# EAGLE design Actuator (EAGLE 9.6.2)

## Sheet 1 of 2
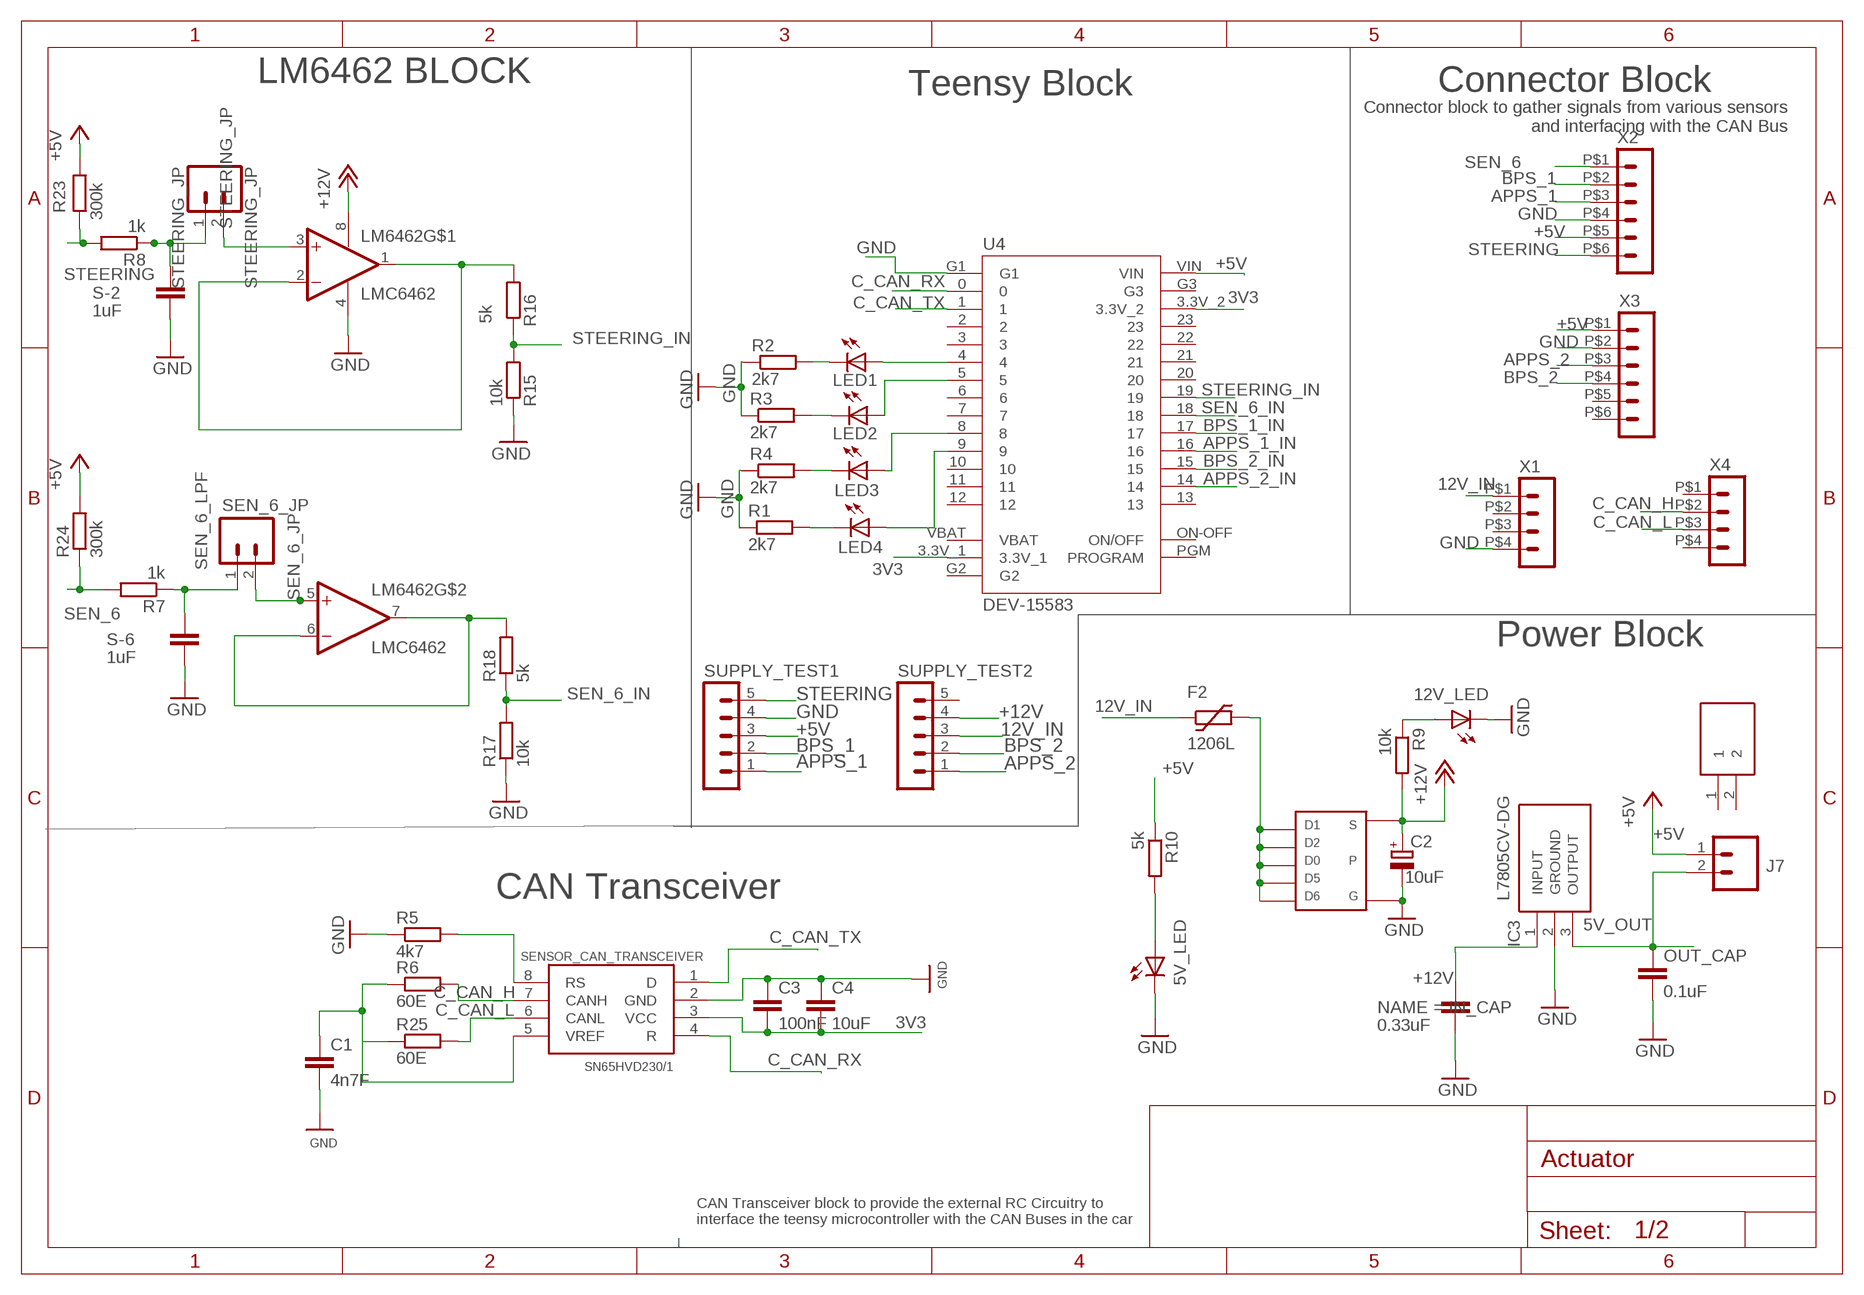
[diagram p0: schematic, sheet 1]

### Parts
5V_LED  LED1206  [LED-1206]
12V_LED  LED1206  [LED-1206]
C1  4n7F  C-EUC0805  [C0805]
C2  10uF  CPOL-EUE2.5-6  [E2,5-6]
C3  100nF  C-EUC0805  [C0805]
C4  10uF  C-EUC0805  [C0805]
F2  1206L  [1206L]
IC3  L7805CV-DG  [TO255P460X1020X2008-3P]
IN_CAP  0.33uF  C-EUC0805  [C0805]
J7  CONN_02  [1X02]
LED1  LED1206  [LED-1206]
LED2  LED1206  [LED-1206]
LED3  LED1206  [LED-1206]
LED4  LED1206  [LED-1206]
LM6462  LMC6462  [S08]
OUT_CAP  0.1uF  C-EUC0805  [C0805]
R1  2k7  R-EU_R0805  [R0805]
R2  2k7  R-EU_R0805  [R0805]
R3  2k7  R-EU_R0805  [R0805]
R4  2k7  R-EU_R0805  [R0805]
R5  4k7  R-EU_R0805  [R0805]
R6  60E  R-EU_R0805  [R0805]
R7  1k  R-EU_R0805  [R0805]
R8  1k  R-EU_R0805  [R0805]
R9  10k  R-EU_R0805  [R0805]
R10  5k  R-EU_R0805  [R0805]
R15  10k  R-EU_R0805  [R0805]
R16  5k  R-EU_R0805  [R0805]
R17  10k  R-EU_R0805  [R0805]
R18  5k  R-EU_R0805  [R0805]
R23  300k  R-EU_R0805  [R0805]
R24  300k  R-EU_R0805  [R0805]
R25  60E  R-EU_R0805  [R0805]
S-2  1uF  C-EUC0805  [C0805]
S-6  1uF  C-EUC0805  [C0805]
SEN_6_JP  SEN_6_JP  CONN_02  [1X02]
SENSOR_CAN_TRANSCEIVER  SN65HVD230/1  [SO8]
STEERING_JP  STEERING_JP  CONN_02  [1X02]
SUPPLY_TEST1  MA05-1  [MA05-1]
SUPPLY_TEST2  MA05-1  [MA05-1]
U3  HSS10-B20-P40  [HSS10B20P40]
U4  DEV-15583  [MODULE_DEV-15583]
U$1  TSOP-6_PMOS  [TSOP-6_PMOS]
X1  HEADER_POS4_43045-0412  [43045-0412]
X2  HEADER_POS6_43045-0612  [43045-0612]
X3  HEADER_POS6_43045-0612  [43045-0612]
X4  HEADER_POS4_43045-0412  [43045-0412]

### Nets
3V3: C3.2 C4.2 SENSOR_CAN_TRANSCEIVER.3(VCC) U4.3.3V_1 U4.3.3V_2
5V_OUT: IC3.3(OUTPUT) J7.2 OUT_CAP.1
12V_IN: F2.P$1 SUPPLY_TEST2.3 X1.P$1
+5V: J7.1 R10.1 R23.2 R24.2 SUPPLY_TEST1.3 U4.VIN X2.P$5 X3.P$1 ; also sheet 2
+12V: C2.+ IC3.1(INPUT) IN_CAP.1 LM6462.8(V+) R9.2 SUPPLY_TEST2.4 U$1.S ; also sheet 2
APPS_1: SUPPLY_TEST1.1 X2.P$3 ; also sheet 2
APPS_1_IN: U4.16 ; also sheet 2
APPS_2: SUPPLY_TEST2.1 X3.P$3 ; also sheet 2
APPS_2_IN: U4.14 ; also sheet 2
BPS_1: SUPPLY_TEST1.2 X2.P$2 ; also sheet 2
BPS_1_IN: U4.17 ; also sheet 2
BPS_2: SUPPLY_TEST2.2 X3.P$4 ; also sheet 2
BPS_2_IN: U4.15 ; also sheet 2
C_CAN_H: R6.2 SENSOR_CAN_TRANSCEIVER.7(CANH) X4.P$2
C_CAN_L: R25.2 SENSOR_CAN_TRANSCEIVER.6(CANL) X4.P$3
C_CAN_RX: SENSOR_CAN_TRANSCEIVER.4(R) U4.0
C_CAN_TX: SENSOR_CAN_TRANSCEIVER.1(D) U4.1
GND: 5V_LED.C 12V_LED.C C1.2 C2.- C3.1 C4.1 IC3.2(GROUND) IN_CAP.2 LM6462.4(V-) OUT_CAP.2 R1.1 R2.1 R3.1 R4.1 R5.1 R15.1 R17.1 S-2.2 S-6.2 SENSOR_CAN_TRANSCEIVER.2(GND) SUPPLY_TEST1.4 U4.G1 U$1.G X1.P$4 X2.P$4 X3.P$2 ; also sheet 2
N$1: R8.1 S-2.1 STEERING_JP.1
N$2: 5V_LED.A R10.2
N$4: R5.2 SENSOR_CAN_TRANSCEIVER.8(RS)
N$5: LED1.A U4.4
N$6: LED2.A U4.5
N$7: C1.1 R6.1 R25.1 SENSOR_CAN_TRANSCEIVER.5(VREF)
N$8: LED3.A U4.8
N$9: F2.P$2 U$1.1 U$1.2 U$1.5 U$1.6 U$1.D(D0)
N$10: LM6462.1(OUT) LM6462.2(-IN) R16.2
N$11: LED4.A U4.9
N$12: LED3.C R4.2
N$13: LED4.C R1.2
N$14: LED2.C R3.2
N$15: 12V_LED.A R9.1
N$16: LED1.C R2.2
N$18: LM6462.6(-IN) LM6462.7(OUT) R18.2
SEN_6: R7.2 R24.1 X2.P$1
SEN_6_IN: R17.2 R18.1 U4.18
SEN_6_JP: LM6462.5(+IN) SEN_6_JP.2
SEN_6_LPF: R7.1 S-6.1 SEN_6_JP.1
STEERING: R8.2 R23.1 SUPPLY_TEST1.5 X2.P$6
STEERING_IN: R15.2 R16.1 U4.19
STEERING_JP: LM6462.3(+IN) STEERING_JP.2
Unconnected: SUPPLY_TEST2.5 U3.1 U3.2 U4.2 U4.3 U4.6 U4.7 U4.10 U4.11 U4.12 U4.13 U4.20 U4.21 U4.22 U4.23 U4.ON-OFF(ON/OFF) U4.PGM(PROGRAM) X1.P$2 X1.P$3 X3.P$5 X3.P$6 X4.P$1 X4.P$4

### Notes on the sheet
- LM6462 BLOCK | Connector Block
- Teensy Block
- Connector block to gather signals from various sensors
   and interfacing with the CAN Bus
- Power Block
- CAN Transceiver
- CAN Transceiver block to provide the external RC Circuitry to 
  interface the teensy microcontroller with the CAN Buses in the car

## Sheet 2 of 2
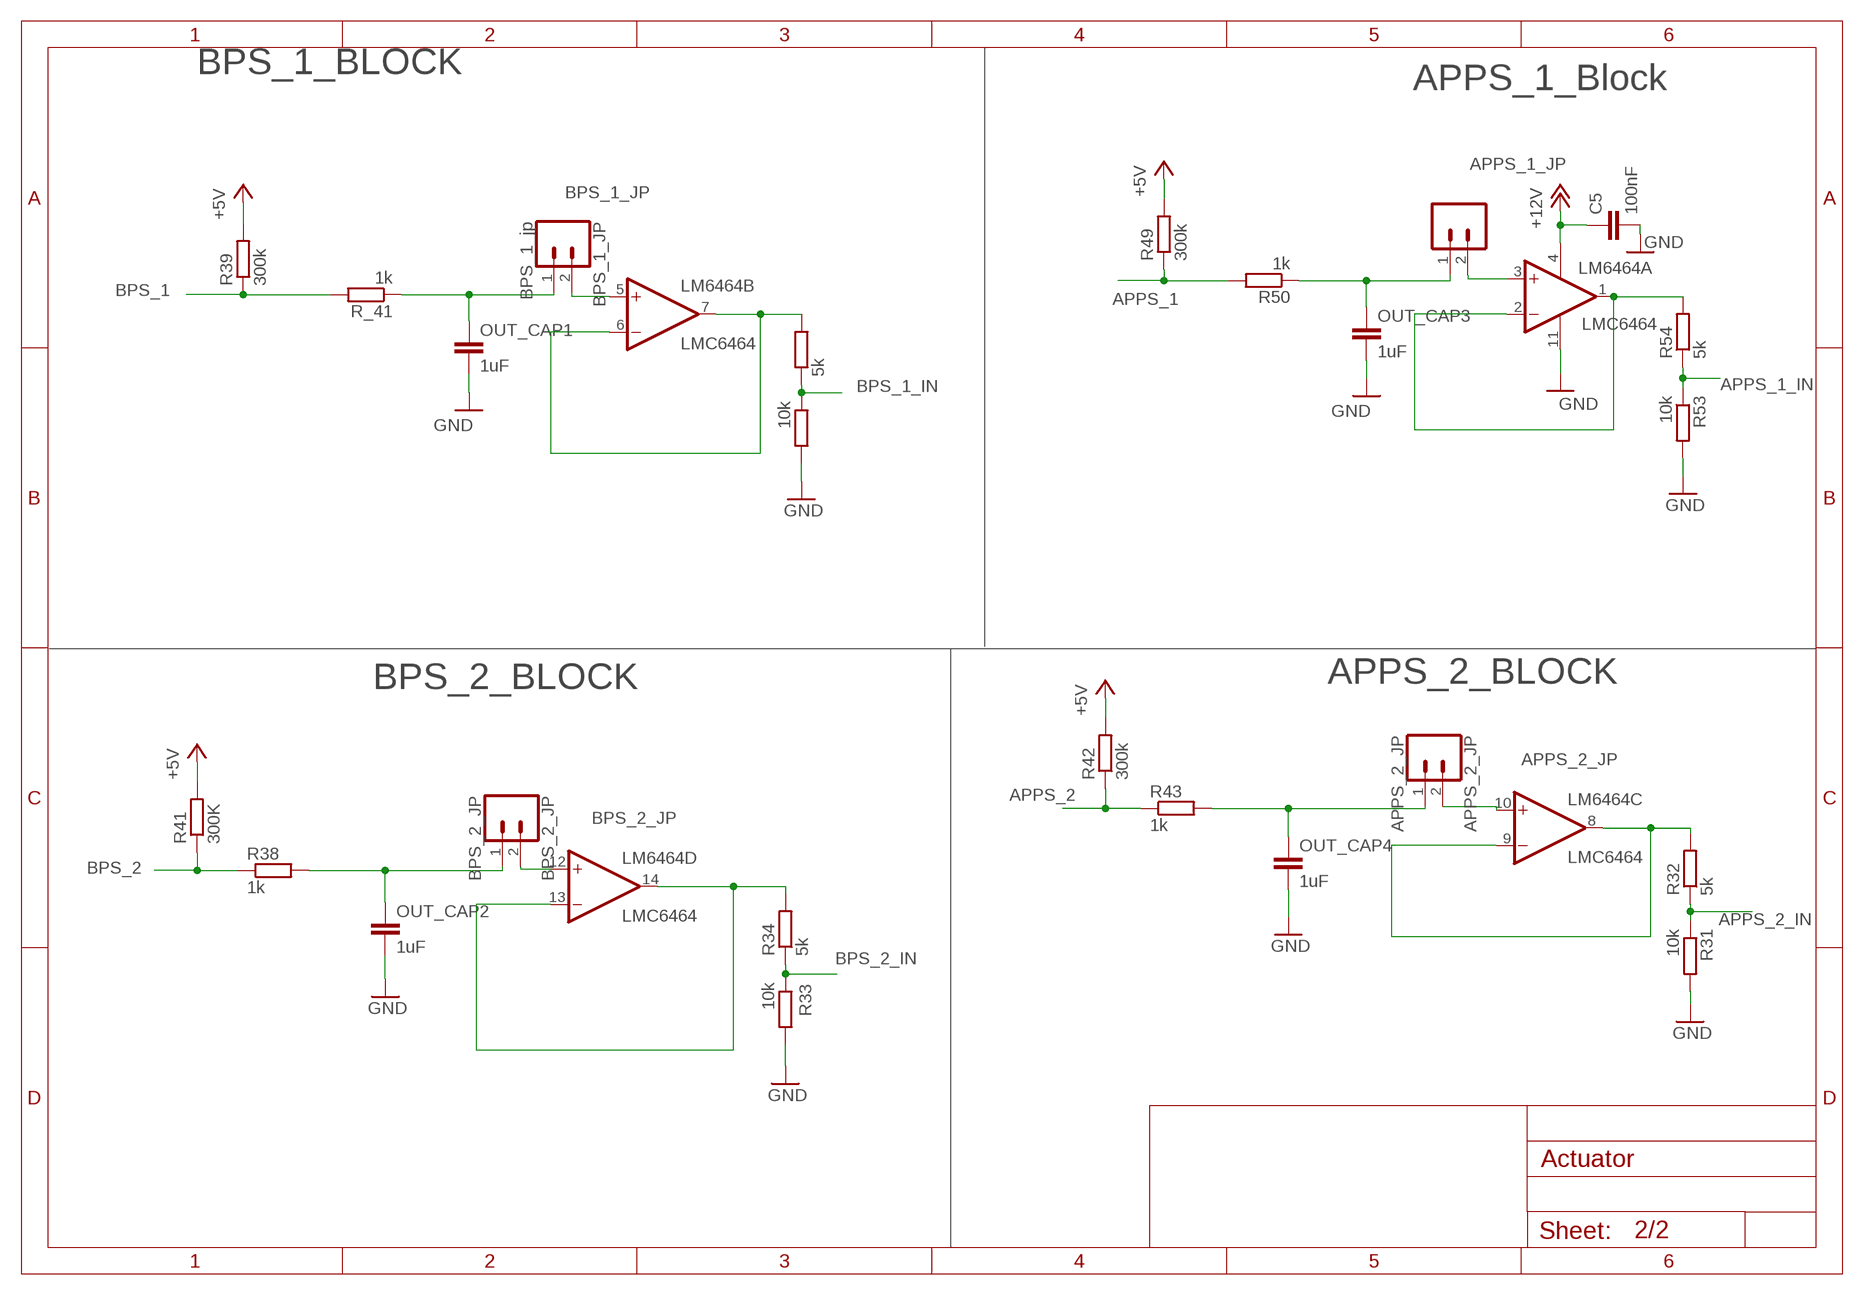
[diagram p1: schematic, sheet 2]

### Parts
APPS_1_JP  CONN_02  [1X02]
APPS_2_JP  APPS_2_JP  CONN_02  [1X02]
BPS_1_JP  BPS_1_jp  CONN_02  [1X02]
BPS_2_JP  BPS_2_JP  CONN_02  [1X02]
C5  100nF  C-EUC0805  [C0805]
LM6464  LMC6464  [SO14_LONGPADS]
OUT_CAP1  1uF  C-EUC0805  [C0805]
OUT_CAP2  1uF  C-EUC0805  [C0805]
OUT_CAP3  1uF  C-EUC0805  [C0805]
OUT_CAP4  1uF  C-EUC0805  [C0805]
R29  10k  R-EU_R0805  [R0805]
R30  5k  R-EU_R0805  [R0805]
R31  10k  R-EU_R0805  [R0805]
R32  5k  R-EU_R0805  [R0805]
R33  10k  R-EU_R0805  [R0805]
R34  5k  R-EU_R0805  [R0805]
R38  1k  R-EU_R0805  [R0805]
R39  300k  R-EU_R0805  [R0805]
R41  300K  R-EU_R0805  [R0805]
R42  300k  R-EU_R0805  [R0805]
R43  1k  R-EU_R0805  [R0805]
R49  300k  R-EU_R0805  [R0805]
R50  1k  R-EU_R0805  [R0805]
R53  10k  R-EU_R0805  [R0805]
R54  5k  R-EU_R0805  [R0805]
R_41  1k  R-EU_R0805  [R0805]

### Nets
+5V: R39.2 R41.2 R42.2 R49.2 ; also sheet 1
+12V: C5.1 LM6464.4(POW:V+) ; also sheet 1
APPS_1: R49.1 R50.2 ; also sheet 1
APPS_1_IN: R53.1 R54.1 ; also sheet 1
APPS_1_JP: APPS_1_JP.2 LM6464.3(A:+IN)
APPS_2: R42.1 R43.1 ; also sheet 1
APPS_2_IN: R31.1 R32.1 ; also sheet 1
APPS_2_JP: APPS_2_JP.2 LM6464.10(C:+IN)
BPS_1: R39.1 R_41.2 ; also sheet 1
BPS_1_IN: R29.1 R30.1 ; also sheet 1
BPS_1_JP: BPS_1_JP.2 LM6464.5(B:+IN)
BPS_2: R38.1 R41.1 ; also sheet 1
BPS_2_IN: R33.1 R34.1 ; also sheet 1
BPS_2_JP: BPS_2_JP.2 LM6464.12(D:+IN)
GND: C5.2 LM6464.11(POW:V-) OUT_CAP1.2 OUT_CAP2.2 OUT_CAP3.2 OUT_CAP4.2 R29.2 R31.2 R33.2 R53.2 ; also sheet 1
N$19: BPS_1_JP.1 OUT_CAP1.1 R_41.1
N$22: LM6464.8(C:OUT) LM6464.9(C:-IN) R32.2
N$25: LM6464.6(B:-IN) LM6464.7(B:OUT) R30.2
N$26: LM6464.13(D:-IN) LM6464.14(D:OUT) R34.2
N$29: APPS_2_JP.1 OUT_CAP4.1 R43.2
N$32: BPS_2_JP.1 OUT_CAP2.1 R38.2
N$33: APPS_1_JP.1 OUT_CAP3.1 R50.1
N$35: LM6464.1(A:OUT) LM6464.2(A:-IN) R54.2

### Notes on the sheet
- BPS_1_BLOCK
- APPS_1_Block
- BPS_2_BLOCK | APPS_2_BLOCK

## Power pins joined to a net without a drawn wire
G2: U4.G2
G3: U4.G3
VBAT: U4.VBAT

## Library data of the parts
5V_LED 12V_LED LED1-LED4 = SparkFun-LED:LED: LEDs Standard schematic elements and footprints for 5mm, 3mm, 1206, and 0603 sized LEDs. 5mm - Spark Fun Electronics SKU : COM-00529 (and others)
APPS_1_JP APPS_2_JP BPS_1_JP BPS_2_JP SEN_6_JP STEERING_JP = IIT_BOMBAY_Racing2:CONN_02: Multi connection point. Often used as Generic Header-pin footprint for 0.1 inch spaced/style header connections On any of the 0.1 inch spaced packages, you can populate with these: Break Away Headers - Straight <https://www.sparkfun.com/products/116> (PRT-00116) Break Away Male Headers - Right Angle <https://www.sparkfun.com/products/553> (PRT-00553) Female Headers <https://www.sparkfun.com/products/115> (PRT-00115) Break Away Headers - Machine Pin <https://www.sparkfun.com/products/117> (PRT-00117) Break Away Female Headers - Swiss Machine Pin <https://www.sparkfun.com/products/743> (PRT-00743) For SCREWTERMINALS and SPRING TERMINALS visit here: Screw Terimnals on SparkFun.com <https://www.sparkfun.com/search/results?term=Screw+Terminals> (5mm/3.5mm/2.54mm spacing) This device is also useful as a general connection point to wire up your design to another part of your project. Our various solder wires solder well into these plated through hole pads. Hook-Up Wire - Assortment (Stranded, 22 AWG) <https://www.sparkfun.com/products/11375> (PRT-11375) Hook-Up Wire - Assortment (Solid Core, 22 AWG) <https://www.sparkfun.com/products/11367> (PRT-11367) View the entire wire category on our website here <https://www.sparkfun.com/categories/141> Special notes: Molex polarized connector foot print use with: PRT-08233 with associated crimp pins and housings. 2.54_SCREWTERM for use with PRT-10571. 3.5mm Screw Terminal footprints for PRT-08084 5mm Screw Terminal footprints for use with PRT-08432
C1 C3-C5 IN_CAP OUT_CAP OUT_CAP1-OUT_CAP4 S-2 S-6 = IIT_BOMBAY_Racing:C-EU: CAPACITOR, European symbol
C2 = IIT_BOMBAY_Racing:CPOL-EU: POLARIZED CAPACITOR, European symbol
F2 = IIT_BOMBAY_Racing:1206L
IC3 = SamacSys_Parts:L7805CV-DG: Voltage Regulator 5V 4% 1.5A TO220 L7805CV-DG, Linear Voltage Regulator, Current Limit, Shut-Down 1.5A 5 V, 3-Pin TO220 Source: Datasheet <http://www.st.com/web/en/resource/technical/document/datasheet/CD00000444.pdf>; DESCRIPTION: Voltage Regulator 5V 4% 1.5A TO220 L7805CV-DG, Linear Voltage Regulator, Current Limit, Shut-Down 1.5A 5 V, 3-Pin TO220; HEIGHT: 4.6mm; MANUFACTURER_NAME: STMicroelectronics; MANUFACTURER_PART_NUMBER: L7805CV-DG; MOUSER_PART_NUMBER: 511-L7805CV-DG; MOUSER_PRICE-STOCK: https://www.mouser.co.uk/ProductDetail/STMicroelectronics/L7805CV-DG?qs=T%2FOtf55vL7c3O0as9P9fAw%3D%3D
J7 = SparkFun-Connectors:CONN_02: Multi connection point. Often used as Generic Header-pin footprint for 0.1 inch spaced/style header connections On any of the 0.1 inch spaced packages, you can populate with these: Break Away Headers - Straight <https://www.sparkfun.com/products/116> (PRT-00116) Break Away Male Headers - Right Angle <https://www.sparkfun.com/products/553> (PRT-00553) Female Headers <https://www.sparkfun.com/products/115> (PRT-00115) Break Away Headers - Machine Pin <https://www.sparkfun.com/products/117> (PRT-00117) Break Away Female Headers - Swiss Machine Pin <https://www.sparkfun.com/products/743> (PRT-00743) For SCREWTERMINALS and SPRING TERMINALS visit here: Screw Terimnals on SparkFun.com <https://www.sparkfun.com/search/results?term=Screw+Terminals> (5mm/3.5mm/2.54mm spacing) This device is also useful as a general connection point to wire up your design to another part of your project. Our various solder wires solder well into these plated through hole pads. Hook-Up Wire - Assortment (Stranded, 22 AWG) <https://www.sparkfun.com/products/11375> (PRT-11375) Hook-Up Wire - Assortment (Solid Core, 22 AWG) <https://www.sparkfun.com/products/11367> (PRT-11367) View the entire wire category on our website here <https://www.sparkfun.com/categories/141> Special notes: Molex polarized connector foot print use with: PRT-08233 with associated crimp pins and housings. 2.54_SCREWTERM for use with PRT-10571. 3.5mm Screw Terminal footprints for PRT-08084 5mm Screw Terminal footprints for use with PRT-08432
LM6462 = IIT_BOMBAY_Racing:LMC6462
LM6464 = IIT_BOMBAY_Racing2:LMC6464
R1-R4 = rcl:R-EU_: RESISTOR, European symbol; SPICEPREFIX: R
R5 R6 R9 R10 R25 = IIT_BOMBAY_Racing:R-EU_: RESISTOR, European symbol
R7 R8 R15-R18 R23 R24 R29-R34 R38 R39 R41-R43 R49 R50 R53 R54 R_41 = IIT_BOMBAY_Racing2:R-EU_: RESISTOR, European symbol
SENSOR_CAN_TRANSCEIVER = texas_1:SN65HVD230/1
SUPPLY_TEST1 SUPPLY_TEST2 = con-lstb:MA05-1: PIN HEADER; OC_FARNELL: unknown; OC_NEWARK: unknown
U3 = HSS10-B20-P40:HSS10-B20-P40: Heat Sinks heat sink, stamping, TO-220, 29.97 x 25. Source: Datasheet <https://www.cuidevices.com/product/resource/hss10-b20-p40.pdf>; DESCRIPTION: Heat Sinks heat sink, stamping, TO-220, 29.97 x 25.; HEIGHT: 29.97mm; MANUFACTURER_NAME: CUI Inc.; MANUFACTURER_PART_NUMBER: HSS10-B20-P40; MOUSER_PART_NUMBER: 490-HSS10-B20-P40; MOUSER_PRICE-STOCK: https://www.mouser.co.uk/ProductDetail/CUI-Devices/HSS10-B20-P40?qs=QNEnbhJQKvYYvwy4FCjq1A%3D%3D
U4 = DEV-15583:DEV-15583: RT1062 Teensy 4.0 i.MX ARM?? Cortex??-M7 MPU Embedded Evaluation Board Check availability <https://pricing.snapeda.com/parts/DEV-15583/SparkFun%20Electronics/view-part?ref=eda>; AVAILABILITY: In Stock; DESCRIPTION: RT1062 Teensy 4.0 series ARM?? Cortex??-M7 MPU Embedded Evaluation Board; MF: SparkFun Electronics; MP: DEV-15583; PACKAGE: None; PRICE: None; PURCHASE-URL: https://pricing.snapeda.com/search/part/DEV-15583/?ref=eda
U$1 = TSOP-6_MOS:TSOP-6_PMOS
X1 X4 = IIT_BOMBAY_Racing2:HEADER_POS4_?: Molex - Micro-Fit 3.0 Series connector, 3.00mm (0.118") pitch header, 4 positions.
X2 X3 = IIT_BOMBAY_Racing2:HEADER_POS6_?: Molex - Micro-Fit 3.0 Series connector, 3.00mm (0.118") pitch header, 6 positions.

## Board
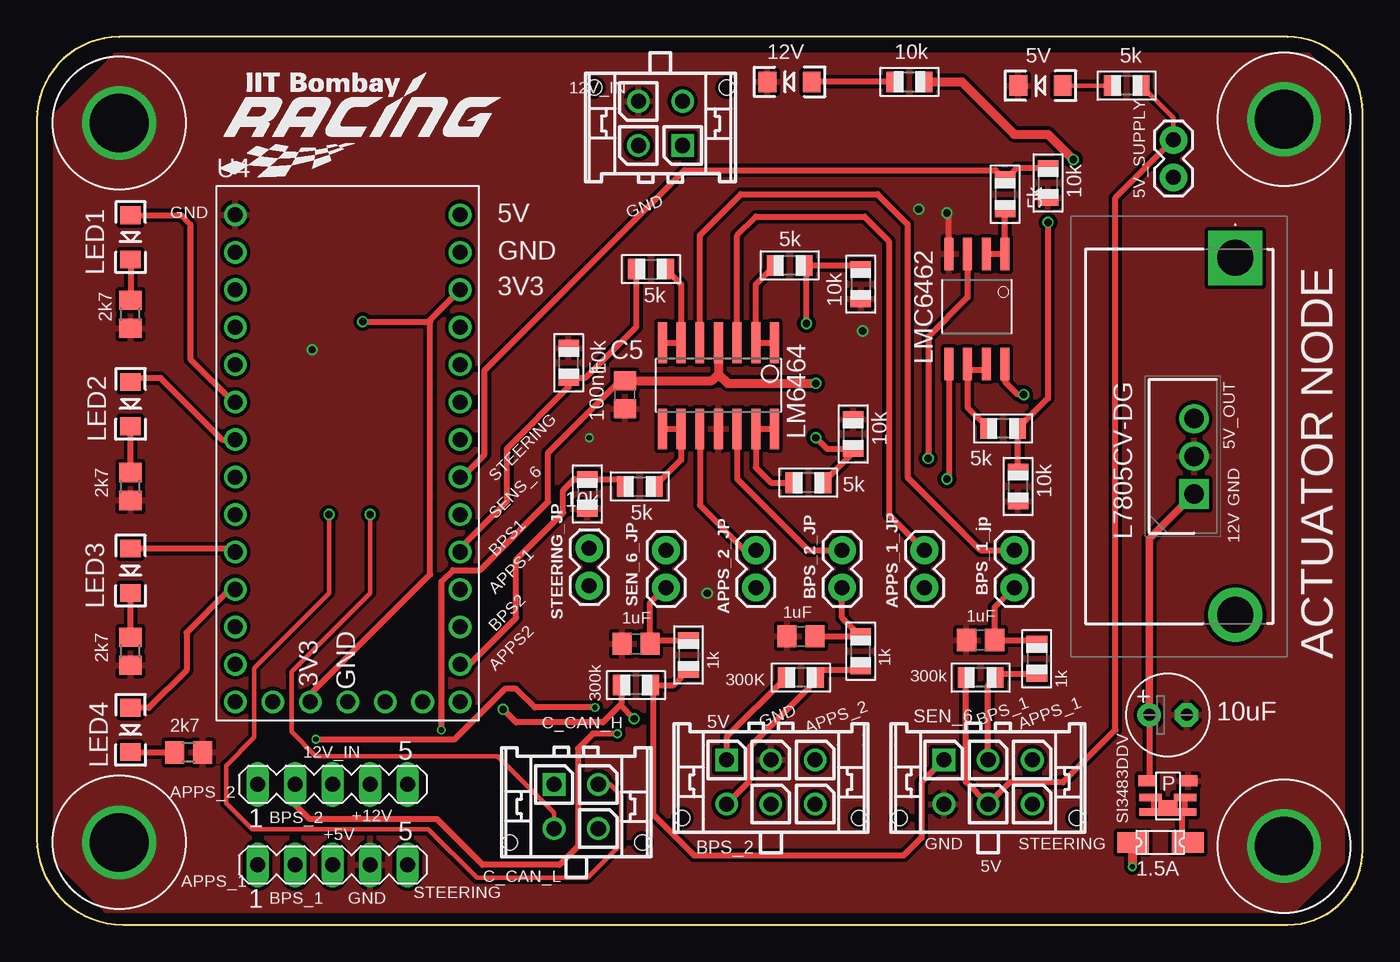
[diagram p2: board, top side]
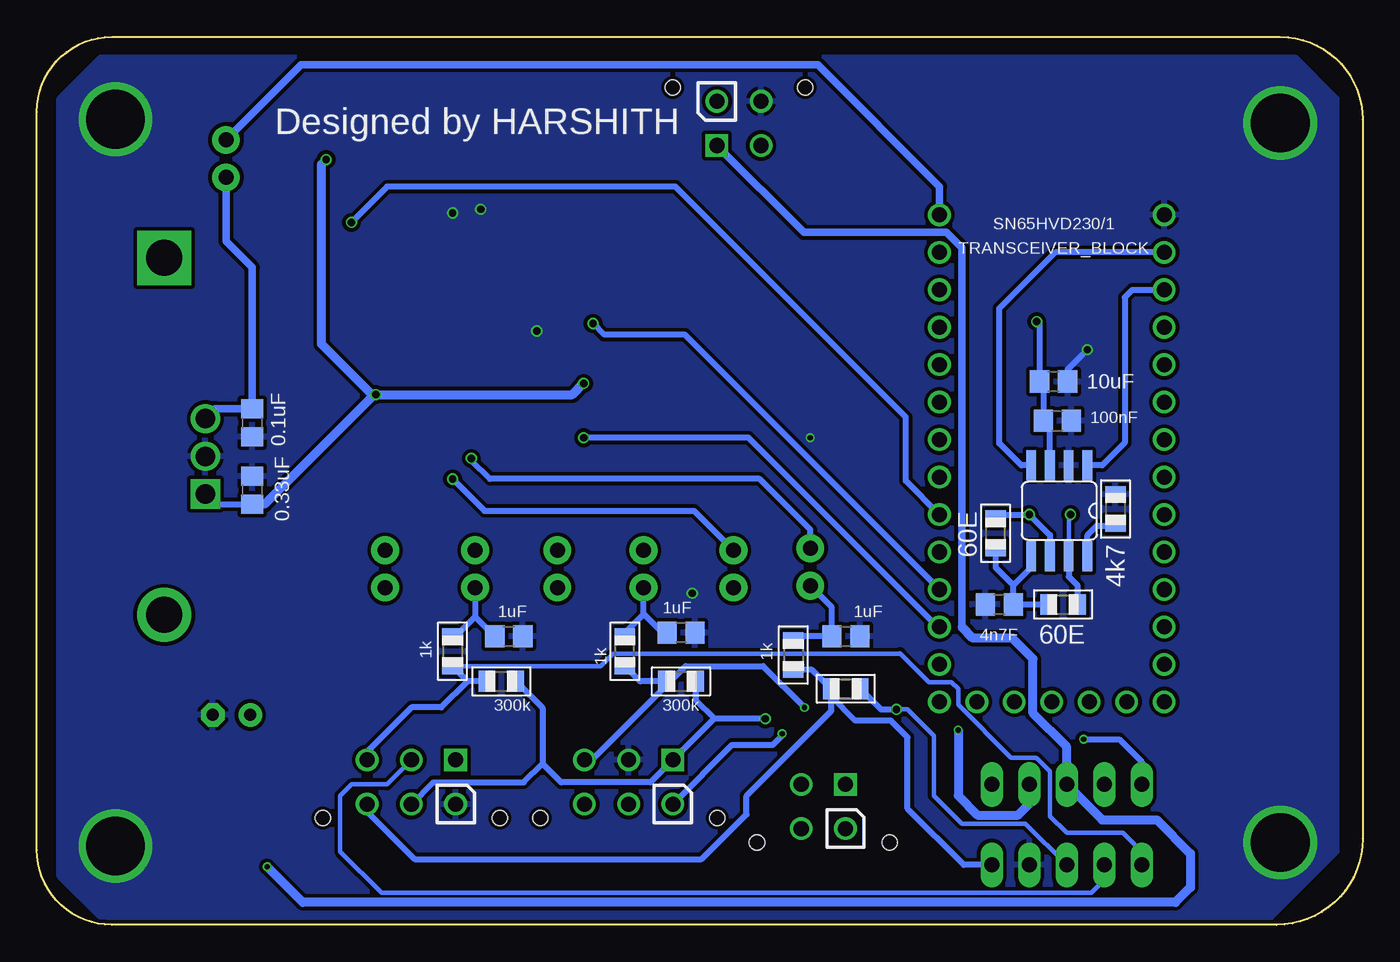
[diagram p3: board, bottom side, seen from below]

Size 89.92 x 60.2 mm. Coordinates in mm from the lower left corner, seen from the top.
Outline: 0,54.61 0,5.84 arc90 5.84,0 84.84,0 arc90 89.92,5.08 89.92,55.12 arc90 84.84,60.2 5.59,60.2 arc90 0,54.61
Copper layers (1*16): Top 0.035mm / dielectric 1.5mm / Bottom 0.035mm
Design rules "PCB_Power": minimum track width 5mil, minimum drill 10mil, track to track 5mil, track to pad 5mil, pad to pad 5mil, via to via 5mil, smd to smd 5mil, copper to edge 10mil, drill to drill 6mil, minimum pad ring 5mil, minimum via ring 5mil, stop-mask expansion 3mil, vias tented up to drill 0mil, thermal gap 10mil

### Footprints (pad centres in the part's own frame; a part is rotated, then mirrored left to right if it is on the bottom)
LED-1206 = smd 1.2 x 1.4: A -1.5,0; C 1.5,0
1X02 = drill 1.016 pad 1.88: 1 0,0; 2 2.54,0
C0805 = smd 1.3 x 1.5: 1 -0.95,0; 2 0.95,0
E2,5-6 = drill 0.813 pad 1.6: + -1.27,0 | drill 0.813 pad 1.6 octagon: - 1.27,0
1206L = smd 2.16 x 1.4: P$1 -1.85,0; P$2 1.85,0
TO255P460X1020X2008-3P = drill 1.32 pad 1.98 square: 1 0,0 | drill 1.32 pad 1.98: 2 2.55,0; 3 5.1,0
S08 = smd 0.61 x 2.21: 1 -1.905,-3.569; 2 -0.635,-3.569; 3 0.635,-3.569; 4 1.905,-3.569; 5 1.905,3.886; 6 0.635,3.886; 7 -0.635,3.886; 8 -1.905,3.886
SO14_LONGPADS = smd 0.61 x 2.762: 1 -6.35,-1.61; 2 -5.08,-1.61; 3 -3.81,-1.61; 4 -2.54,-1.61; 5 -1.27,-1.61; 6 0,-1.61; 7 1.27,-1.61; 8 1.27,4.226; 9 0,4.226; 10 -1.27,4.226; 11 -2.54,4.226; 12 -3.81,4.226; 13 -5.08,4.226; 14 -6.35,4.226
R0805 = smd 1.3 x 1.5: 1 -0.95,0; 2 0.95,0
R0805' = smd 1.1 x 1.4: 1 -1,0; 2 1,0
SO8 = smd 0.66 x 2.032: 1 -1.905,-3.073; 2 -0.635,-3.073; 3 0.635,-3.073; 4 1.905,-3.073; 5 1.905,3.073; 6 0.635,3.073; 7 -0.635,3.073; 8 -1.905,3.073
MA05-1 = drill 1.016 long: 1 -5.08,0; 2 -2.54,0; 3 0,0; 4 2.54,0; 5 5.08,0
HSS10B20P40 = drill 2.45 pad 3.675 square: 1 0,0 | drill 2.45 pad 3.675: 2 24.2,0
MODULE_DEV-15583 = drill 1.02: 0 -7.62,13.97; 1 -7.62,11.43; 2 -7.62,8.89; 3 -7.62,6.35; 3.3V_1 -2.54,-16.51; 3.3V_2 7.62,11.43; 4 -7.62,3.81; 5 -7.62,1.27; 6 -7.62,-1.27; 7 -7.62,-3.81; 8 -7.62,-6.35; 9 -7.62,-8.89; 10 -7.62,-11.43; 11 -7.62,-13.97; 12 -7.62,-16.51; 13 7.62,-16.51; 14 7.62,-13.97; 15 7.62,-11.43; 16 7.62,-8.89; 17 7.62,-6.35; 18 7.62,-3.81; 19 7.62,-1.27; 20 7.62,1.27; 21 7.62,3.81; 22 7.62,6.35; 23 7.62,8.89; G1 -7.62,16.51; G2 0,-16.51; G3 7.62,13.97; ON-OFF 5.08,-16.51; PGM 2.54,-16.51; VBAT -5.08,-16.51; VIN 7.62,16.51
TSOP-6_PMOS = smd 0.5 x 1.92: 1 -1,-0.96; 6 -1,0.96 | smd 0.5 x 1.52: 2 0,-1.16; 5 0,1.16 | smd 0.635 x 1.27: D -0.5,0 | smd 0.75 x 1.2: G 1.13,-1.4; S 1.13,1.4
43045-0412 = drill 1.02 square: P$1 1.5,0 | drill 1.02: P$2 -1.5,0; P$3 1.5,3; P$4 -1.5,3 | hole 1.02: 4.5,3.94; -4.5,3.94
43045-0612 = drill 1.02 square: P$1 3,0 | drill 1.02: P$2 0,0; P$3 -3,0; P$4 3,3; P$5 0,3; P$6 -3,3 | hole 1.02: 6,3.94; -6,3.94

### Placement (x,y rotation side)
5V_LED  68.07,56.9 180 top
12V_LED  51.05,57.15 180 top
APPS_1_JP  60.2,22.86 90 top
APPS_2_JP  48.77,22.86 90 top
BPS_1_JP  66.29,22.86 90 top
BPS_2_JP  54.61,22.86 90 top
C1  24.64,21.72 180 bottom
C2  76.71,14.22 0 top
C3  20.7,34.16 180 bottom
C4  20.96,36.83 180 bottom
C5  39.88,35.94 270 top
F2  76.2,5.59 0 top
IC3  78.49,29.21 90 top
IN_CAP  75.31,29.46 90 bottom
J7  77.09,53.21 270 top
LED1  6.35,46.61 270 top
LED2  6.35,35.31 270 top
LED3  6.35,24 270 top
LED4  6.35,13.21 270 top
LM6462  63.75,41.91 180 top
LM6464  43.69,37.85 180 top
OUT_CAP  75.31,34.04 270 bottom
OUT_CAP1  64.01,19.3 180 top
OUT_CAP2  51.82,19.56 180 top
OUT_CAP3  57.91,19.56 0 bottom
OUT_CAP4  46.23,19.81 0 bottom
R1  10.29,11.68 180 top
R2  6.35,41.4 90 top
R3  6.35,29.72 90 top
R4  6.35,18.54 90 top
R5  4k7  [R0805']  16.76,28.19 270 bottom
R6  60E  [R0805']  20.32,21.72 0 bottom
R7  1k  [R0805']  44.2,18.29 270 top
R8  1k  [R0805']  38.61,18.29 270 bottom
R9  10k  [R0805']  59.18,57.15 0 top
R10  5k  [R0805']  73.91,56.9 180 top
R15  10k  [R0805']  68.58,50.29 90 top
R16  5k  [R0805']  65.66,49.53 270 top
R17  10k  [R0805']  66.55,29.72 90 top
R18  5k  [R0805']  65.53,33.66 180 top
R23  300k  [R0805']  35.05,16 0 bottom
R24  300k  [R0805']  40.64,16.26 180 top
R25  60E  [R0805']  24.89,26.54 90 bottom
R29  10k  [R0805']  36.07,38.1 90 top
R30  5k  [R0805']  41.66,44.45 0 top
R31  10k  [R0805']  37.34,29.21 270 top
R32  5k  [R0805']  40.89,29.72 0 top
R33  10k  [R0805']  55.37,33.27 90 top
R34  5k  [R0805']  52.32,29.97 180 top
R38  1k  [R0805']  55.88,18.54 90 top
R39  300k  [R0805']  64.01,16.76 180 top
R41  300K  [R0805']  51.82,16.76 180 top
R42  300k  [R0805']  46.23,16.51 0 bottom
R43  1k  [R0805']  50.04,18.54 90 bottom
R49  300k  [R0805']  58.42,16.51 0 bottom
R50  1k  [R0805']  61.72,18.54 270 bottom
R53  10k  [R0805']  55.88,43.43 270 top
R54  5k  [R0805']  51.05,44.7 180 top
R_41  1k  [R0805']  67.82,18.03 270 top
S-2  35.05,19.56 0 bottom
S-6  40.64,19.05 180 top
SEN_6_JP  42.67,22.86 90 top
SENSOR_CAN_TRANSCEIVER  20.57,28.07 180 bottom
STEERING_JP  37.47,22.99 90 top
SUPPLY_TEST1  20.07,4.06 0 top
SUPPLY_TEST2  20.07,9.53 0 top
U3  81.28,45.21 270 top
U4  21.08,31.62 0 top
U$1  76.71,8.64 90 top
U$5  [RACING_LOGO_290MIL]  12.07,50.42 0 top
X1  42.29,52.83 0 top
X2  64.52,11.18 180 top
X3  49.78,11.18 180 top
X4  36.58,9.53 180 top

### Tracks (layer width: path | path; a pad name or v marks a point on that pad's centre or on a via)
3V3  (via drill 0.5 pad 0.65)
  Top 0.406: U4.3.3V_2 26.54,40.89 | v22.1,40.89 26.54,40.89 | 26.54,40.89 26.67,40.89 26.67,23.75 18.54,15.62 U4.3.3V_1
  Bottom 0.406: SENSOR_CAN_TRANSCEIVER.3 21.21,33.72 C3.2 21.65,36.58 C4.2 21.91,40.7 v22.1,40.89
5V_OUT
  Bottom 0.508: J7.2 77.09,46.35 75.31,44.58 OUT_CAP.1 77.81,34.99 IC3.3
12V_IN  (via drill 0.35)
  Top 0.406: F2.P$1 74.29,5.53
  Top 0.61: 74.29,5.53 v74.29,3.94
  Bottom 0.508: 27.18,20.19 27.18,45.89 28.23,46.94 37.9,46.94 X1.P$1
  Bottom 0.61: 27.18,20.19 26.42,19.43 23.75,19.43 22.35,18.03 22.35,14.35 20.07,12.07 SUPPLY_TEST2.3 17.65,7.11 13.97,7.11 11.68,4.83 11.68,2.54 12.7,1.52 71.88,1.52 v74.29,3.94
+5V  (via drill 0.5 pad 0.65)
  Top 0.305: J7.1 77.09,54.72 R10.1
  Top 0.406: R39.2 63.01,9.68 X2.P$5 65.99,9.65 69.6,9.65 73.15,13.21 73.15,49.28 J7.1 | R41.2 46.78,12.73 X3.P$1 | R24.2 39.64,14.97 39.58,14.91 | 39.58,14.91 v40.51,13.97 | 39.58,14.91 38.39,13.72 32.51,13.72 v31.62,14.61
  Bottom 0.305: SUPPLY_TEST1.3 22.86,6.86 27.18,6.86 29.08,8.76 29.08,12.83 30.86,14.61 v31.62,14.61
  Bottom 0.406: 43.99,13.97 43.97,13.99 45.21,15.24 45.21,16.51 R42.2 | 43.99,13.97 X3.P$1 48.31,9.65 54.36,9.65 55.63,10.92 | v40.51,13.97 43.99,13.97 | X2.P$5 63.04,9.65 56.9,9.65 55.63,10.92 | R49.2 55.63,14.72 55.63,10.92 | R23.2 32.66,14.61 v31.62,14.61
  Bottom 0.508: U4.VIN 28.7,50.04 36.96,58.29 72.01,58.29 J7.1
+12V  (via drill 0.35, 0.5 pad 0.65, 0.5 pad 0.7)
  Top 0.406: C2.+ 75.44,9.9 U$1.S | v66.93,35.94 66.55,35.94 65.66,36.83 LM6462.8 | v27.43,13.21 27.43,23.27 28.22,24.05 30.05,24.05 34.67,28.68 34.67,32 39.62,36.96
  Top 0.508: C2.+ 75.44,26.16 IC3.1
  Top 0.61: LM6464.4 46.23,37.34 | v70.29,51.88 68.58,53.59 66.29,53.59 62.74,57.15 R9.2 | 46.23,37.34 46.86,36.7 v52.83,36.7 | 46.23,37.34 45.78,36.89 C5.1 39.62,36.89 39.62,36.96
  Bottom 0.406: IC3.1 77.79,28.51 IN_CAP.1 74.48,28.51 | 70.61,51.56 v70.29,51.88
  Bottom 0.61: 74.48,28.51 67.06,35.94 v66.93,35.94 | v52.83,36.7 53.59,35.94 v66.93,35.94 | v66.93,35.94 67.18,35.94 70.61,39.37 70.61,51.56 | v27.43,13.21 27.43,8.76 26.11,7.44 23.37,7.44 22.61,8.2 SUPPLY_TEST2.4
APPS_1
  Bottom 0.305: R50.2 51.68,17.54 50.85,18.37 31.41,18.37 31.37,18.42 29.4,16.45 27.88,16.45 27.43,16 27.43,14.91 23.85,11.33 22.18,11.33 22.15,11.3 22.1,11.3 21.21,10.41 21.21,7.37 20.07,6.22 16.26,6.22 14.99,4.95 SUPPLY_TEST1.1
  Bottom 0.406: X2.P$3 67.52,11.73 64.52,14.73 62.48,14.73 60.71,16.51 | R49.1 60.71,16.51 | R50.2 61.72,17.53 60.71,16.51
APPS_1_IN  (via drill 0.5 pad 0.65)
  Top 0.406: v52.2,40.77 52.2,44.56 R54.1 55.61,44.7 R53.1
  Bottom 0.406: U4.16 45.97,40 51.44,40 v52.2,40.77
APPS_1_JP
  Top 0.406: LM6464.3 47.5,46.74 48.77,48.01 56.13,48.01 57.79,46.35 57.79,27.81 APPS_1_JP.2
APPS_2  (via drill 0.35)
  Top 0.406: v37.85,14.73 33.78,14.73 32.51,16 31.75,16 28.32,12.57 v18.92,12.57
  Bottom 0.406: X3.P$3 52.28,11.18 47.23,16.22 R42.1 | R42.1 49.01,16.51 R43.1 | R42.1 46.95,16.51 45.91,17.54 40.65,17.54 v37.85,14.73 | v18.92,12.57 16.51,12.57 14.99,11.05 SUPPLY_TEST2.1
APPS_2_IN
  Top 0.406: R32.1 39.76,29.85 39.4,30.21 R31.1 36.43,30.21 35.69,29.46 35.69,27.94 32.51,24.77 32.51,20.83 29.34,17.65 U4.14
APPS_2_JP
  Top 0.406: LM6464.10 44.96,28.45 48.01,25.4 APPS_2_JP.2
BPS_1
  Top 0.406: X2.P$2 64.52,16.27 R39.1 65.28,17.03 R_41.2
  Bottom 0.305: SUPPLY_TEST1.2 17.53,3.05 18.41,2.16 66.55,2.16 69.34,4.95 69.34,8.76 68.58,9.53 66.17,9.53 X2.P$2
BPS_1_IN
  Top 0.406: U4.17 28.7,25.53 31.88,28.7 31.88,32.27 36.07,36.46 R29.1 37.23,37.1 40.66,40.53 R30.1
BPS_1_JP
  Top 0.406: LM6464.5 44.96,46.74 47.75,49.53 57.02,49.53 59.05,47.5 59.05,30.35 64.01,25.4 BPS_1_JP.2
BPS_2  (via drill 0.35)
  Top 0.406: X3.P$4 48.31,9.7 48.31,12.01 52.82,16.52 R41.1 53.32,17.27 55.88,17.27 R38.1 | SUPPLY_TEST2.2 17.53,8.13 18.48,7.18 27.11,7.18 30.23,4.06 35.43,4.06 36.7,5.33 36.7,11.94 37.72,12.95 v39.37,12.95
  Bottom 0.406: X3.P$4 42.77,12.19 40.01,12.19 39.37,12.83 v39.37,12.96
  Bottom 0.61: v39.37,12.95 v39.37,12.96
BPS_2_IN  (via drill 0.5 pad 0.65)
  Top 0.406: R34.1 55.37,32.02 R33.1 53.59,32.27 52.85,33.02 v52.83,33.02
  Bottom 0.406: U4.15 28.84,20.19 41.66,33.02 v52.83,33.02
BPS_2_JP
  Top 0.406: LM6464.12 47.5,30.23 52.32,25.4 BPS_2_JP.2
C_CAN_H  (via drill 0.5 pad 0.65)
  Top 0.305: v19.81,27.81 19.81,22.48 14.73,17.4 14.73,12.7 12.83,10.8 12.83,8.26 14.61,6.48 26.54,6.48 29.84,3.17 37.34,3.17 39.62,5.46 39.62,8.76 38.86,9.53 X4.P$2
  Bottom 0.305: SENSOR_CAN_TRANSCEIVER.7 19.94,27.69 v19.81,27.81
  Bottom 0.406: R6.2 19.32,22.99 19.94,23.61 SENSOR_CAN_TRANSCEIVER.7
C_CAN_L  (via drill 0.5 pad 0.65)
  Top 0.305: v22.61,27.81 22.61,22.48 17.27,17.14 17.27,13.08 18.92,11.43 31.24,11.43 35.08,7.6 X4.P$3
  Bottom 0.406: SENSOR_CAN_TRANSCEIVER.6 21.21,26.42 v22.61,27.81 24.62,27.81 R25.2
C_CAN_RX
  Bottom 0.406: U4.0 20.83,45.59 24.64,41.78 24.64,32.64 23.14,31.14 SENSOR_CAN_TRANSCEIVER.4
C_CAN_TX
  Bottom 0.406: U4.1 15.62,43.05 16.13,42.54 16.13,32.66 17.65,31.14 SENSOR_CAN_TRANSCEIVER.1
GND  (via drill 0.35, 0.5 pad 0.65, 0.5 pad 0.7, 0.5 pad 0.75, 3.98 pad 0.95)
  Top 0.406: LM6462.4 61.85,48.13 v61.72,48.26
  Bottom 0.406: C4.1 20.01,37.65 v18.67,38.99
  other vias: 5.59,54.36 56.01,40.26 59.82,48.51 84.58,5.33 5.59,5.59 84.58,54.61 45.47,22.48 37.47,33.02
  pour Top (isolate 0.254): 5.33,58.93 1.27,54.86 1.27,4.45 4.7,1.02 85.22,1.02 88.52,4.32 88.52,56.64 86.23,58.93
  pour Bottom (isolate 0.254): 4.57,58.8 1.78,56.01 1.78,4.95 6.22,0.51 85.6,0.51 88.39,3.3 88.39,56.01 85.6,58.8
N$1
  Bottom 0.406: R8.1 38.34,19.56 S-2.1 36,21.52 STEERING_JP.1
N$2
  Top 0.305: R10.2 5V_LED.A
N$4
  Bottom 0.406: SENSOR_CAN_TRANSCEIVER.8 18.67,26.42 18.02,27.07 16.89,27.07 R5.2
N$5
  Top 0.406: U4.4 13.34,35.43 10.41,38.35 10.41,47.47 9.78,48.11 LED1.A
N$6
  Top 0.406: U4.5 12.57,32.89 8.41,37.06 6.6,37.06 LED2.A
N$7
  Bottom 0.406: R6.1 C1.1 23.69,23.02 | R25.1 24.89,24.23 23.69,23.02 | 23.69,23.02 22.48,24.23 SENSOR_CAN_TRANSCEIVER.5
N$8
  Top 0.406: U4.8 13.23,25.5 LED3.A
N$9
  Top 0.406: U$1.5 75.75,8.44 U$1.6 76.21,7.64 U$1.D 77.21,7.64 U$1.1 | U$1.1 77.87,7.84 U$1.2 | U$1.1 77.67,5.97 F2.P$2
N$10
  Top 0.406: R16.2 LM6462.1 LM6462.2
N$11
  Top 0.406: U4.9 13.08,22.73 10.16,19.81 10.16,17.27 7.6,14.71 LED4.A
N$12
  Top 0.406: R4.2 LED3.C
N$13
  Top 0.406: LED4.C 9.31,11.71 R1.2
N$14
  Top 0.406: R3.2 LED2.C
N$15
  Top 0.406: R9.1 12V_LED.A
N$16
  Top 0.406: LED1.C R2.2
N$18
  Top 0.406: LM6462.6 63.12,37.59 | 63.12,37.59 63.12,35.07 R18.2 | LM6462.7 64.39,37.59 63.12,37.59
N$19
  Top 0.406: BPS_1_JP.1 64.96,21.52 OUT_CAP1.1 67.55,19.3 R_41.1
N$22
  Top 0.406: R32.2 43.69,31.51 LM6464.9 LM6464.8
N$25
  Top 0.406: R30.2 43.69,43.42 LM6464.6 LM6464.7
N$26
  Top 0.406: R34.2 49.78,29.97 48.77,30.99 LM6464.13 LM6464.14
N$29
  Bottom 0.406: R43.2 50.04,19.8 48.77,21.07 48.77,21.08 | 48.77,21.08 APPS_2_JP.1 | OUT_CAP4.1 47.5,19.81 48.77,21.08
N$32
  Top 0.406: BPS_2_JP.1 54.61,20.81 R38.2 52.78,19.54 OUT_CAP2.1
N$33
  Bottom 0.406: OUT_CAP3.1 60.2,20.89 | APPS_1_JP.1 60.2,20.89 | 60.2,20.89 61.55,19.54 R50.1
N$35
  Top 0.406: R54.2 48.77,43.42 LM6464.2 LM6464.1
SEN_6
  Top 0.406: R7.2 43.16,16.26 R24.1 41.78,16.11 41.78,7.49 44.58,4.7 58.8,4.7 59.99,5.89 59.99,9.66 X2.P$1
SEN_6_IN  (via drill 0.5 pad 0.65)
  Top 0.406: R17.2 66.53,30.73 R18.1 66.55,33.66 68.58,35.69 v68.58,47.62
  Bottom 0.406: v68.58,47.62 66.17,50.04 46.61,50.04 30.99,34.42 30.99,30.1 U4.18
SEN_6_JP  (via drill 0.5 pad 0.65)
  Top 0.406: LM6462.5 61.85,30.35 v61.72,30.23
  Bottom 0.406: v61.72,30.23 59.56,28.07 45.34,28.07 SEN_6_JP.2
SEN_6_LPF
  Top 0.406: R7.1 41.83,19.29 S-6.1 41.59,21.84 42.61,22.86 SEN_6_JP.1
STEERING
  Bottom 0.305: 36.05,15.48 36.05,15.88
  Bottom 0.406: R8.2 37.34,17.29 R23.1 36.05,15.88 36.05,14.48 41.78,8.75 41.78,7.49 44.83,4.45 64.29,4.45 67.52,7.67 X2.P$6 | SUPPLY_TEST1.5 27.05,4.06 30.86,7.87 30.86,12.7 32,13.84 34.42,13.84 36.05,15.48
STEERING_IN
  Top 0.406: U4.19 28.83,30.35 30.35,31.88 30.35,37.59 43.93,51.16 65.02,51.16 R16.1 66.42,51.29 R15.2
STEERING_JP  (via drill 0.5 pad 0.65)
  Top 0.406: LM6462.3 63.12,42.54 60.45,39.88 v60.45,31.62
  Bottom 0.406: v60.45,31.62 60.45,31.5 59.18,30.23 40.89,30.23 37.47,26.8 STEERING_JP.2

### Text on the board
tPlace: 12V | 5V | 2k7 | GND | 2k7 | 2k7 | ACTUATOR NODE | APPS_1 | C_CAN_H | SEN_6 | C_CAN_L
bPlace: Designed by HARSHITH
tNames: 12V_IN | GND | 5V_OUT | 10k | 12V | GND | APPS_2 | BPS_1 | 5V | 2k7 | 12V_IN | APPS_2 | BPS_2 | +12V | +5V | BPS_2 | GND | STEERING | 5V | APPS_1 | STEERING | BPS_1 | GND
bNames: 0.33uF